# EAGLE schematic 40-auxiliary-backplane-board (EAGLE 6.6.0)
AUTHOR: Sean Leavey; COMPANY: ERC Speedmeter; DATE: 2015-03-19; REVISION: 2015-04-30; REVISIONAUTHOR1: Sean Leavey; REVISIONAUTHOR2: Sean Leavey; REVISIONDATE1: 2015-03-30; REVISIONDATE2: 2015-04-30; TITLE: AUXILIARY COIL; TITLE2: DRIVER RACK BACKPLANE BOARD
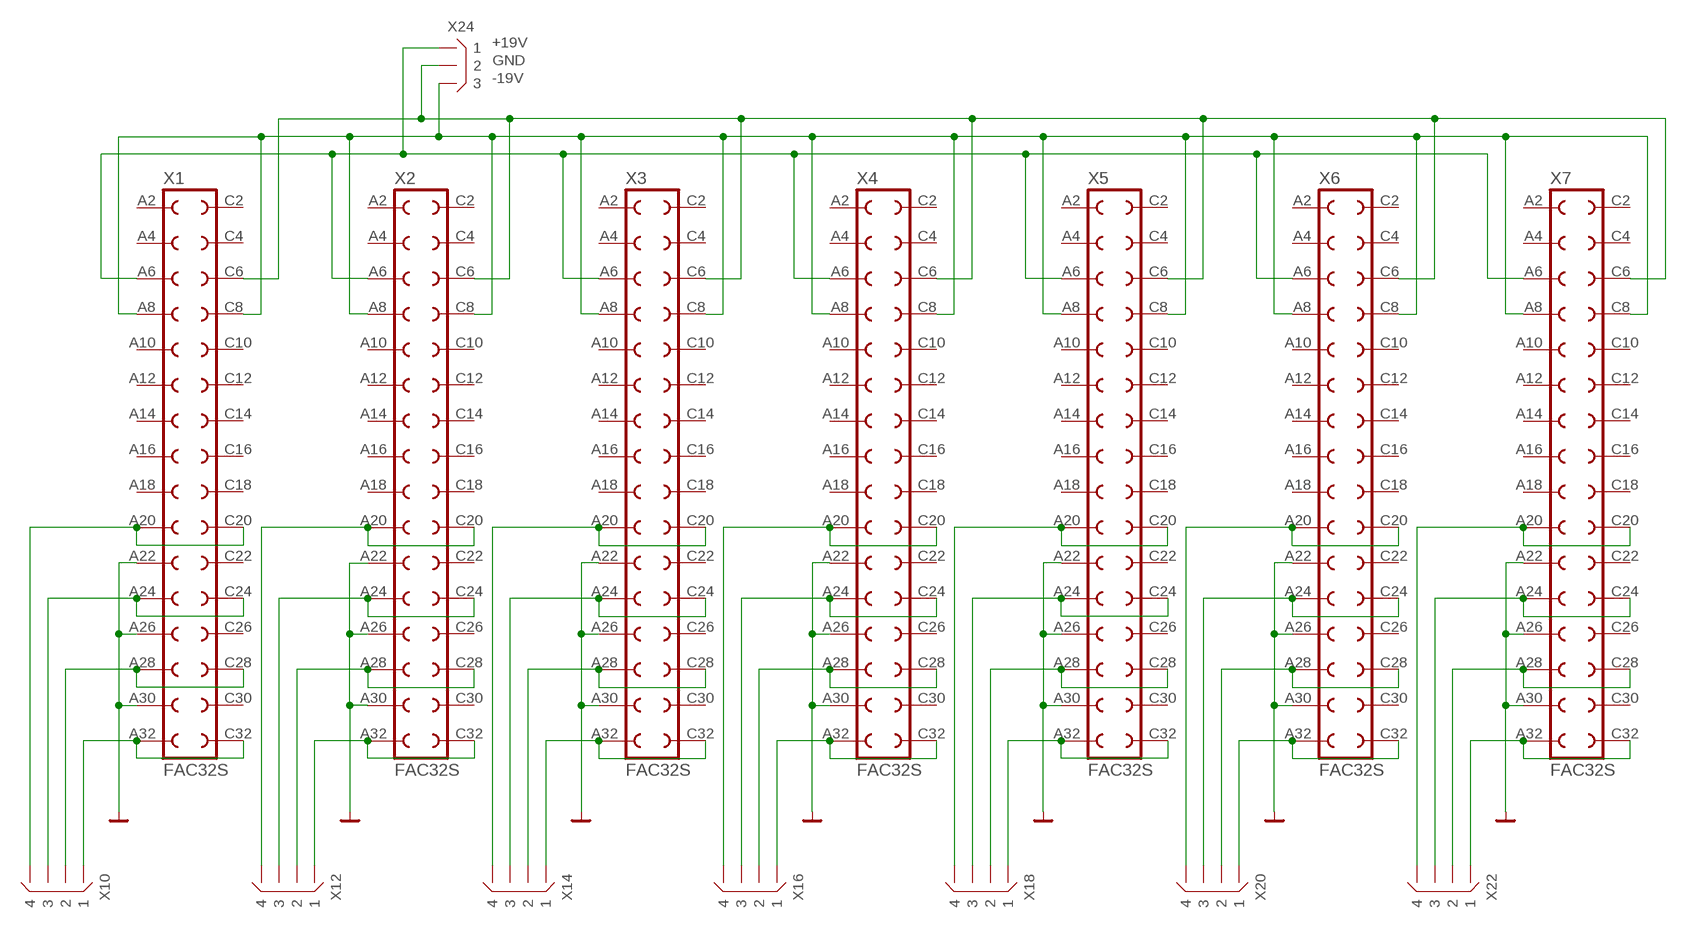
[diagram p0: schematic, sheet 1]

## Parts
X1  FAC32S  [FAC32S]
X2  FAC32S  [FAC32S]
X3  FAC32S  [FAC32S]
X4  FAC32S  [FAC32S]
X5  FAC32S  [FAC32S]
X6  FAC32S  [FAC32S]
X7  FAC32S  [FAC32S]
X10  X04-SCREW  [X04-SCREW]
X12  X04-SCREW  [X04-SCREW]
X14  X04-SCREW  [X04-SCREW]
X16  X04-SCREW  [X04-SCREW]
X18  X04-SCREW  [X04-SCREW]
X20  X04-SCREW  [X04-SCREW]
X22  X04-SCREW  [X04-SCREW]
X24  X03-SCREW  [X03-SCREW]

## Nets
GND: X1.A22 X1.A26 X1.A30 X2.A22 X2.A26 X2.A30 X3.A22 X3.A26 X3.A30 X4.A22 X4.A26 X4.A30 X5.A22 X5.A26 X5.A30 X6.A22 X6.A26 X6.A30 X7.A22 X7.A26 X7.A30 ; supply symbol labelled VG
N$1: X1.A6 X2.A6 X3.A6 X4.A6 X5.A6 X6.A6 X7.A6 X24.1
N$2: X1.A8 X1.C8 X2.A8 X2.C8 X3.A8 X3.C8 X4.A8 X4.C8 X5.A8 X5.C8 X6.A8 X6.C8 X7.A8 X7.C8 X24.3
N$3: X1.C6 X2.C6 X3.C6 X4.C6 X5.C6 X6.C6 X7.C6 X24.2
N$26: X1.A20 X1.C20 X10.4
N$27: X1.A24 X1.C24 X10.3
N$28: X1.A28 X1.C28 X10.2
N$29: X1.A32 X1.C32 X10.1
N$30: X2.A20 X2.C20 X12.4
N$31: X2.A24 X2.C24 X12.3
N$32: X2.A28 X2.C28 X12.2
N$33: X2.A32 X2.C32 X12.1
N$34: X3.A20 X3.C20 X14.4
N$35: X3.A24 X3.C24 X14.3
N$36: X3.A28 X3.C28 X14.2
N$37: X3.A32 X3.C32 X14.1
N$38: X4.A20 X4.C20 X16.4
N$39: X4.A24 X4.C24 X16.3
N$40: X4.A28 X4.C28 X16.2
N$41: X4.A32 X4.C32 X16.1
N$42: X5.A20 X5.C20 X18.4
N$44: X5.A24 X5.C24 X18.3
N$45: X5.A28 X5.C28 X18.2
N$46: X5.A32 X5.C32 X18.1
N$47: X6.A20 X6.C20 X20.4
N$48: X6.A24 X6.C24 X20.3
N$49: X6.A28 X6.C28 X20.2
N$50: X6.A32 X6.C32 X20.1
N$51: X7.A32 X7.C32 X22.1
N$53: X7.A28 X7.C28 X22.2
N$54: X7.A24 X7.C24 X22.3
N$56: X7.A20 X7.C20 X22.4
Unconnected: X1.A2 X1.A4 X1.A10 X1.A12 X1.A14 X1.A16 X1.A18 X1.C2 X1.C4 X1.C10 X1.C12 X1.C14 X1.C16 X1.C18 X1.C22 X1.C26 X1.C30 X2.A2 X2.A4 X2.A10 X2.A12 X2.A14 X2.A16 X2.A18 X2.C2 X2.C4 X2.C10 X2.C12 X2.C14 X2.C16 X2.C18 X2.C22 X2.C26 X2.C30 X3.A2 X3.A4 X3.A10 X3.A12 X3.A14 X3.A16 X3.A18 X3.C2 X3.C4 X3.C10 X3.C12 X3.C14 X3.C16 X3.C18 X3.C22 X3.C26 X3.C30 X4.A2 X4.A4 X4.A10 X4.A12 X4.A14 X4.A16 X4.A18 X4.C2 X4.C4 X4.C10 X4.C12 X4.C14 X4.C16 X4.C18 X4.C22 X4.C26 X4.C30 X5.A2 X5.A4 X5.A10 X5.A12 X5.A14 X5.A16 X5.A18 X5.C2 X5.C4 X5.C10 X5.C12 X5.C14 X5.C16 X5.C18 X5.C22 X5.C26 X5.C30 X6.A2 X6.A4 X6.A10 X6.A12 X6.A14 X6.A16 X6.A18 X6.C2 X6.C4 X6.C10 X6.C12 X6.C14 X6.C16 X6.C18 X6.C22 X6.C26 X6.C30 X7.A2 X7.A4 X7.A10 X7.A12 X7.A14 X7.A16 X7.A18 X7.C2 X7.C4 X7.C10 X7.C12 X7.C14 X7.C16 X7.C18 X7.C22 X7.C26 X7.C30

## Notes on the sheet
- +19V
- GND
- -19V

## Library data of the parts
X1-X7 = con-vg:FAC32S: CONNECTOR female, 32 pins, block, type D, rows AC, grid 5.08 mm
X10 X12 X14 X16 X18 X20 X22 = connectors:X04: Connector 4 pins; IGNOREVALUE: 1; SPICE: <ignore>
X24 = connectors:X03: Connector 3 pins; IGNOREVALUE: 1; SPICE: <ignore>